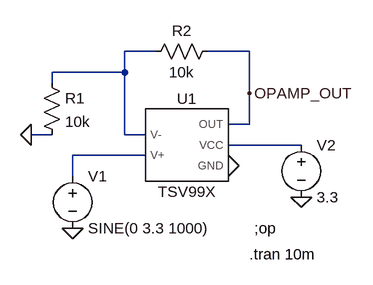
[diagram p0: schematic Simple opamp test.asc]
Simple opamp test.asc, the LTspice schematic file:
Version 4
SHEET 1 880 680
WIRE 128 0 80 0
WIRE 272 0 208 0
WIRE 80 32 80 0
WIRE 80 32 -32 32
WIRE -32 48 -32 32
WIRE 272 64 272 0
WIRE 272 112 272 64
WIRE 272 112 240 112
WIRE -32 128 -64 128
WIRE 80 128 80 32
WIRE 112 128 80 128
WIRE 352 144 240 144
WIRE 112 160 0 160
WIRE 0 192 0 160
FLAG -64 128 0
FLAG 240 176 0
FLAG 0 272 0
FLAG 352 224 0
FLAG 272 64 OPAMP_OUT
SYMBOL AutoGenerated\\TSV99X 176 144 R0
SYMATTR InstName U1
SYMBOL res 112 16 R270
WINDOW 0 32 56 VTop 2
WINDOW 3 0 56 VBottom 2
SYMATTR InstName R2
SYMATTR Value 10k
SYMBOL voltage 0 176 R0
WINDOW 123 0 0 Left 2
WINDOW 39 0 0 Left 2
SYMATTR InstName V1
SYMATTR Value SINE(0 3.3 1000)
SYMBOL voltage 352 128 R0
WINDOW 123 0 0 Left 2
WINDOW 39 0 0 Left 2
SYMATTR InstName V2
SYMATTR Value 3.3
SYMBOL res -48 32 R0
SYMATTR InstName R1
SYMATTR Value 10k
TEXT 280 272 Left 2 !;op
TEXT 272 312 Left 2 !.tran 10m

The netlist it stands for:
* Simple opamp test.asc
XU1 N001 N003 OPAMP_OUT N002 0 TSV99X  ; pins V- V+ OUT VCC GND
R2 N001 OPAMP_OUT 10k
V1 N003 0 SINE(0 3.3 1000)
V2 N002 0 3.3
R1 N001 0 10k
;op
.tran 10m
.lib D:\Github\LTSpice\LTS0000 - Models\TSX631.mod
.backanno
.end